# Altium project Roket_Ana_Bilgisayar.PrjPcb
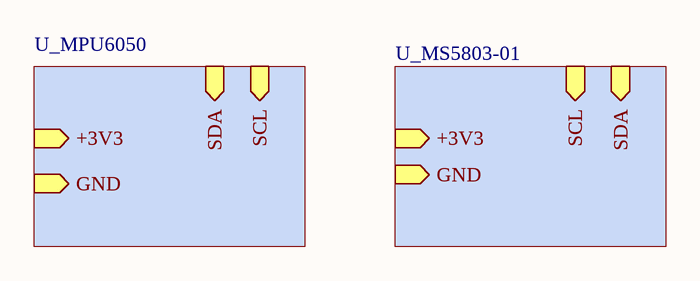
[diagram p0: TopSheet.SchDoc]
3 sheets, 8 parts. Net scope: strictly hierarchical (ports join the sheet entries above them; power ports are local).
Sheets:
  TopSheet.SchDoc
    U_MPU6050 = MPU6050.SchDoc
    U_MS5803-01 = MS5803-01.BA.SchDoc

## Sheet TopSheet.SchDoc: TopSheet
size A4; DrawnBy: Hüseyin; Organization: Altium Limited; Address1: L3, 12a Rodborough Rd; Address2: Frenchs Forest; Address3: NSW; Address4: Australia 2086; Revision: 1; SheetNumber: 1; SheetTotal: 3

### Sub-sheets
U_MPU6050 = MPU6050.SchDoc: GND (in), +3V3 (in), SDA (in), SCL (in)
U_MS5803-01 = MS5803-01.BA.SchDoc: SDA (in), SCL (in), GND (in), +3V3 (in)

### Notes on the sheet
- Size:
- Title
- A4
- DrawnBy
- Revision:
- YBU
- Batı Kampüsü
- Etlik Keçiören
- Date:
- Time:
- Sheet
- of
- Ankara / Türkiye

## Sheet MPU6050.SchDoc: MPU6050
size A4; DrawnBy: Huseyin; Organization: Altium Limited; Address1: L3, 12a Rodborough Rd; Address2: Frenchs Forest; Address3: NSW; Address4: Australia 2086; Revision: 1; SheetNumber: 2; SheetTotal: 3
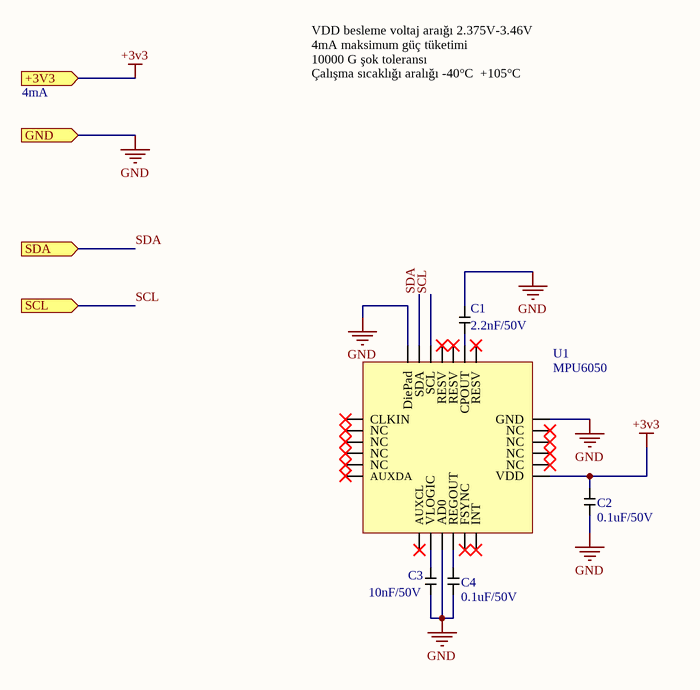
[diagram p1: MPU6050.SchDoc]

### Parts
C1  2.2nF/50V
C2  0.1uF/50V  [Cap_0805]
C3  10nF/50V  [Cap_0805]
C4  0.1uF/50V  [Cap_0805]
U1  MPU6050  [QFN24]

### Ports
+3V3 (in), GND (in), SCL (in), SDA (in)

### Nets
+3v3: C2.1 U1.13(VDD) ; port +3V3
GND: C1.1 C2.2 C3.1 C4.2 U1.9(AD0) U1.18(GND) U1.25(DiePad) ; port GND
SCL: U1.23(SCL) ; port SCL
SDA: U1.24(SDA) ; port SDA
NetC1_1: C1.1 U1.20(CPOUT)
NetC3_2: C3.2 U1.8(VLOGIC)
NetC4_1: C4.1 U1.10(REGOUT)

Not connected (* = marked no-connect by the designer): U1 1(CLKIN)* 2(NC)* 3(NC)* 4(NC)* 5(NC)* 6(AUXDA)* 7(AUXCL)* 11(FSYNC)* 12(INT)* 14(NC)* 15(NC)* 16(NC)* 17(NC)* 19(RESV)* 21(RESV)* 22(RESV)*

### Notes on the sheet
- VDD besleme voltaj araığı 2.375V-3.46V
  4mA maksimum güç tüketimi
  10000 G şok toleransı
  Çalışma sıcaklığı aralığı -40°C  +105°C
- 4mA
- Size:
- Title
- A4
- DrawnBy
- Revision:
- YBU
- Batı Kampüsü
- Etlik Keçiören
- Date:
- Time:
- Sheet
- of
- Ankara / Türkiye

### Library data of the parts
C1 = CL21B222KBANNNC: MLCC (2012) 0805 2.2nF 50VDC ±10% X7R
C2 C4 = CL21B104JBCNNNC: MLCC (2012) 0805 100nF 50VDC ±5% X7R
C3 = CL21B103KBANNNC: MLCC (2012) 0805 10nF 50VDC ±10% X7R
U1 = MPU-6050: IC-6050 SENSOR MOTION QFN24

## Sheet MS5803-01.BA.SchDoc: MS5803
size A4; DrawnBy: Hüseyin; Organization: Altium Limited; Address1: L3, 12a Rodborough Rd; Address2: Frenchs Forest; Address3: NSW; Address4: Australia 2086; Revision: 1; SheetNumber: 3; SheetTotal: 3
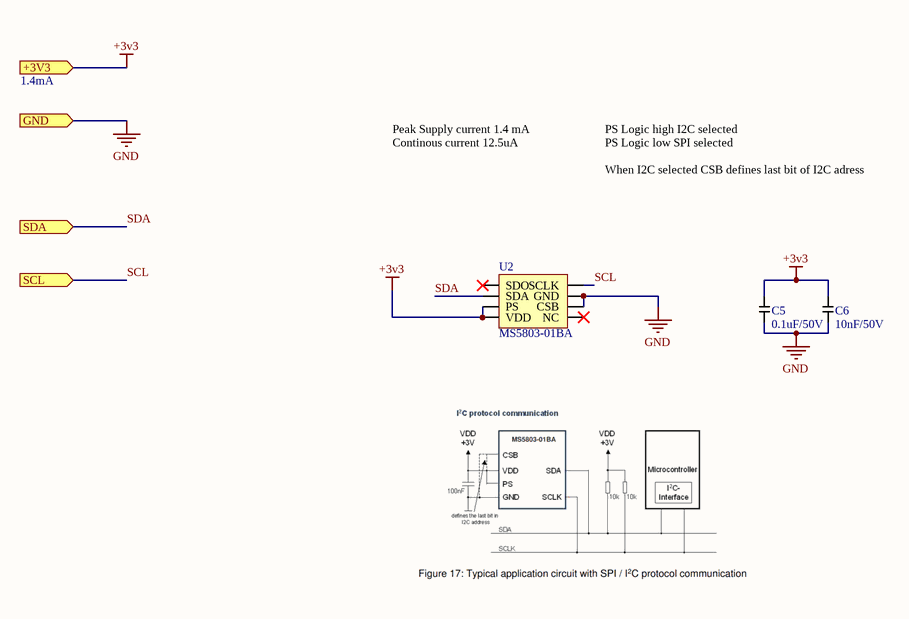
[diagram p2: MS5803-01.BA.SchDoc]

### Parts
C5  0.1uF/50V  [Cap_0805]
C6  10nF/50V  [Cap_0805]
U2  MS5803-01BA  [MS5803-01BA]

### Ports
+3V3 (in), GND (in), SCL (in), SDA (in)

### Nets
+3v3: C5.1 C6.2 U2.5(VDD) U2.6(PS) ; port +3V3
GND: C5.2 C6.1 U2.2(GND) U2.3(CSB) ; port GND
SCL: U2.1(SCLK) ; port SCL
SDA: U2.7(SDA) ; port SDA

Not connected (* = marked no-connect by the designer): U2 4(NC)* 8(SDO)*

### Notes on the sheet
- 1.4mA
- Peak Supply current 1.4 mA
  Continous current 12.5uA
- PS Logic high I2C selected
  PS Logic low SPI selected
  When I2C selected CSB defines last bit of I2C adress
- Size:
- Title
- A4
- DrawnBy
- Revision:
- YBU
- Batı Kampüsü
- Etlik Keçiören
- Date:
- Time:
- Sheet
- of
- Ankara / Türkiye

### Library data of the parts
C5 = CL21B104JBCNNNC: MLCC (2012) 0805 100nF 50VDC ±5% X7R; ComponentLink1Description: özdisan; ComponentLink1URL: CL21B104JBCNNNC
C6 = CL21B103KBANNNC: MLCC (2012) 0805 10nF 50VDC ±10% X7R; ComponentLink1Description: özdisan; ComponentLink1URL: https://ozdisan.com/Product/Detail/5607/CL21B103KBANNNC
U2 = MS5803-01BA: Pressure Sensor 0.15PSI ~ 18.85PSI (1kPa ~ 130kPa) Absolute 24 b 8-SMD Module